# Altium schematic sheet LED.SchDoc
size C
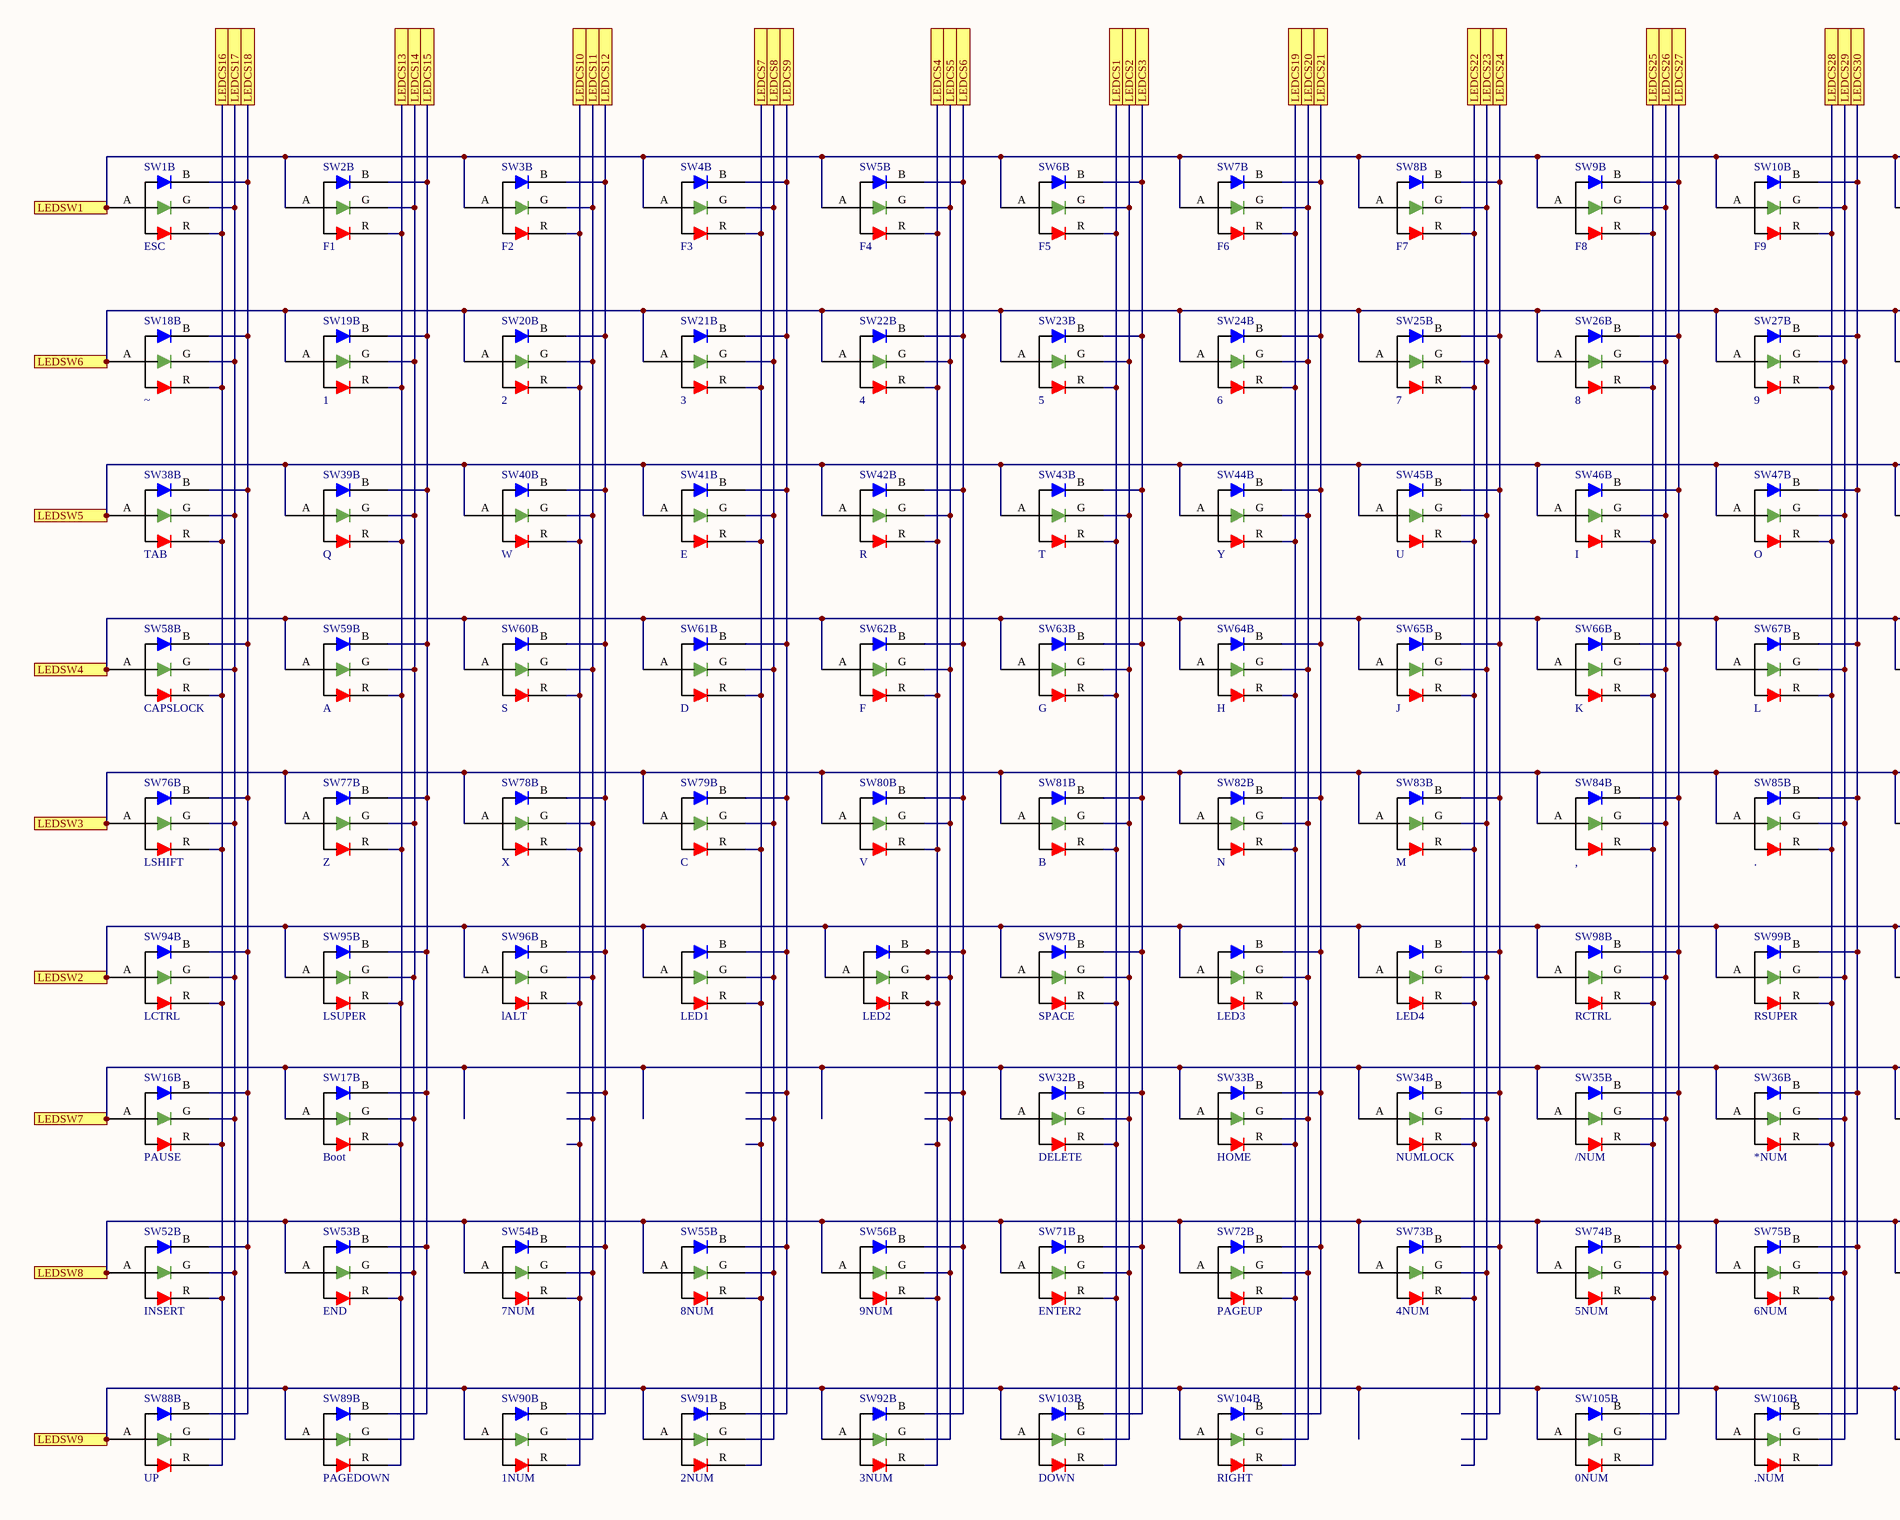
[diagram p0: LED.SchDoc, left]
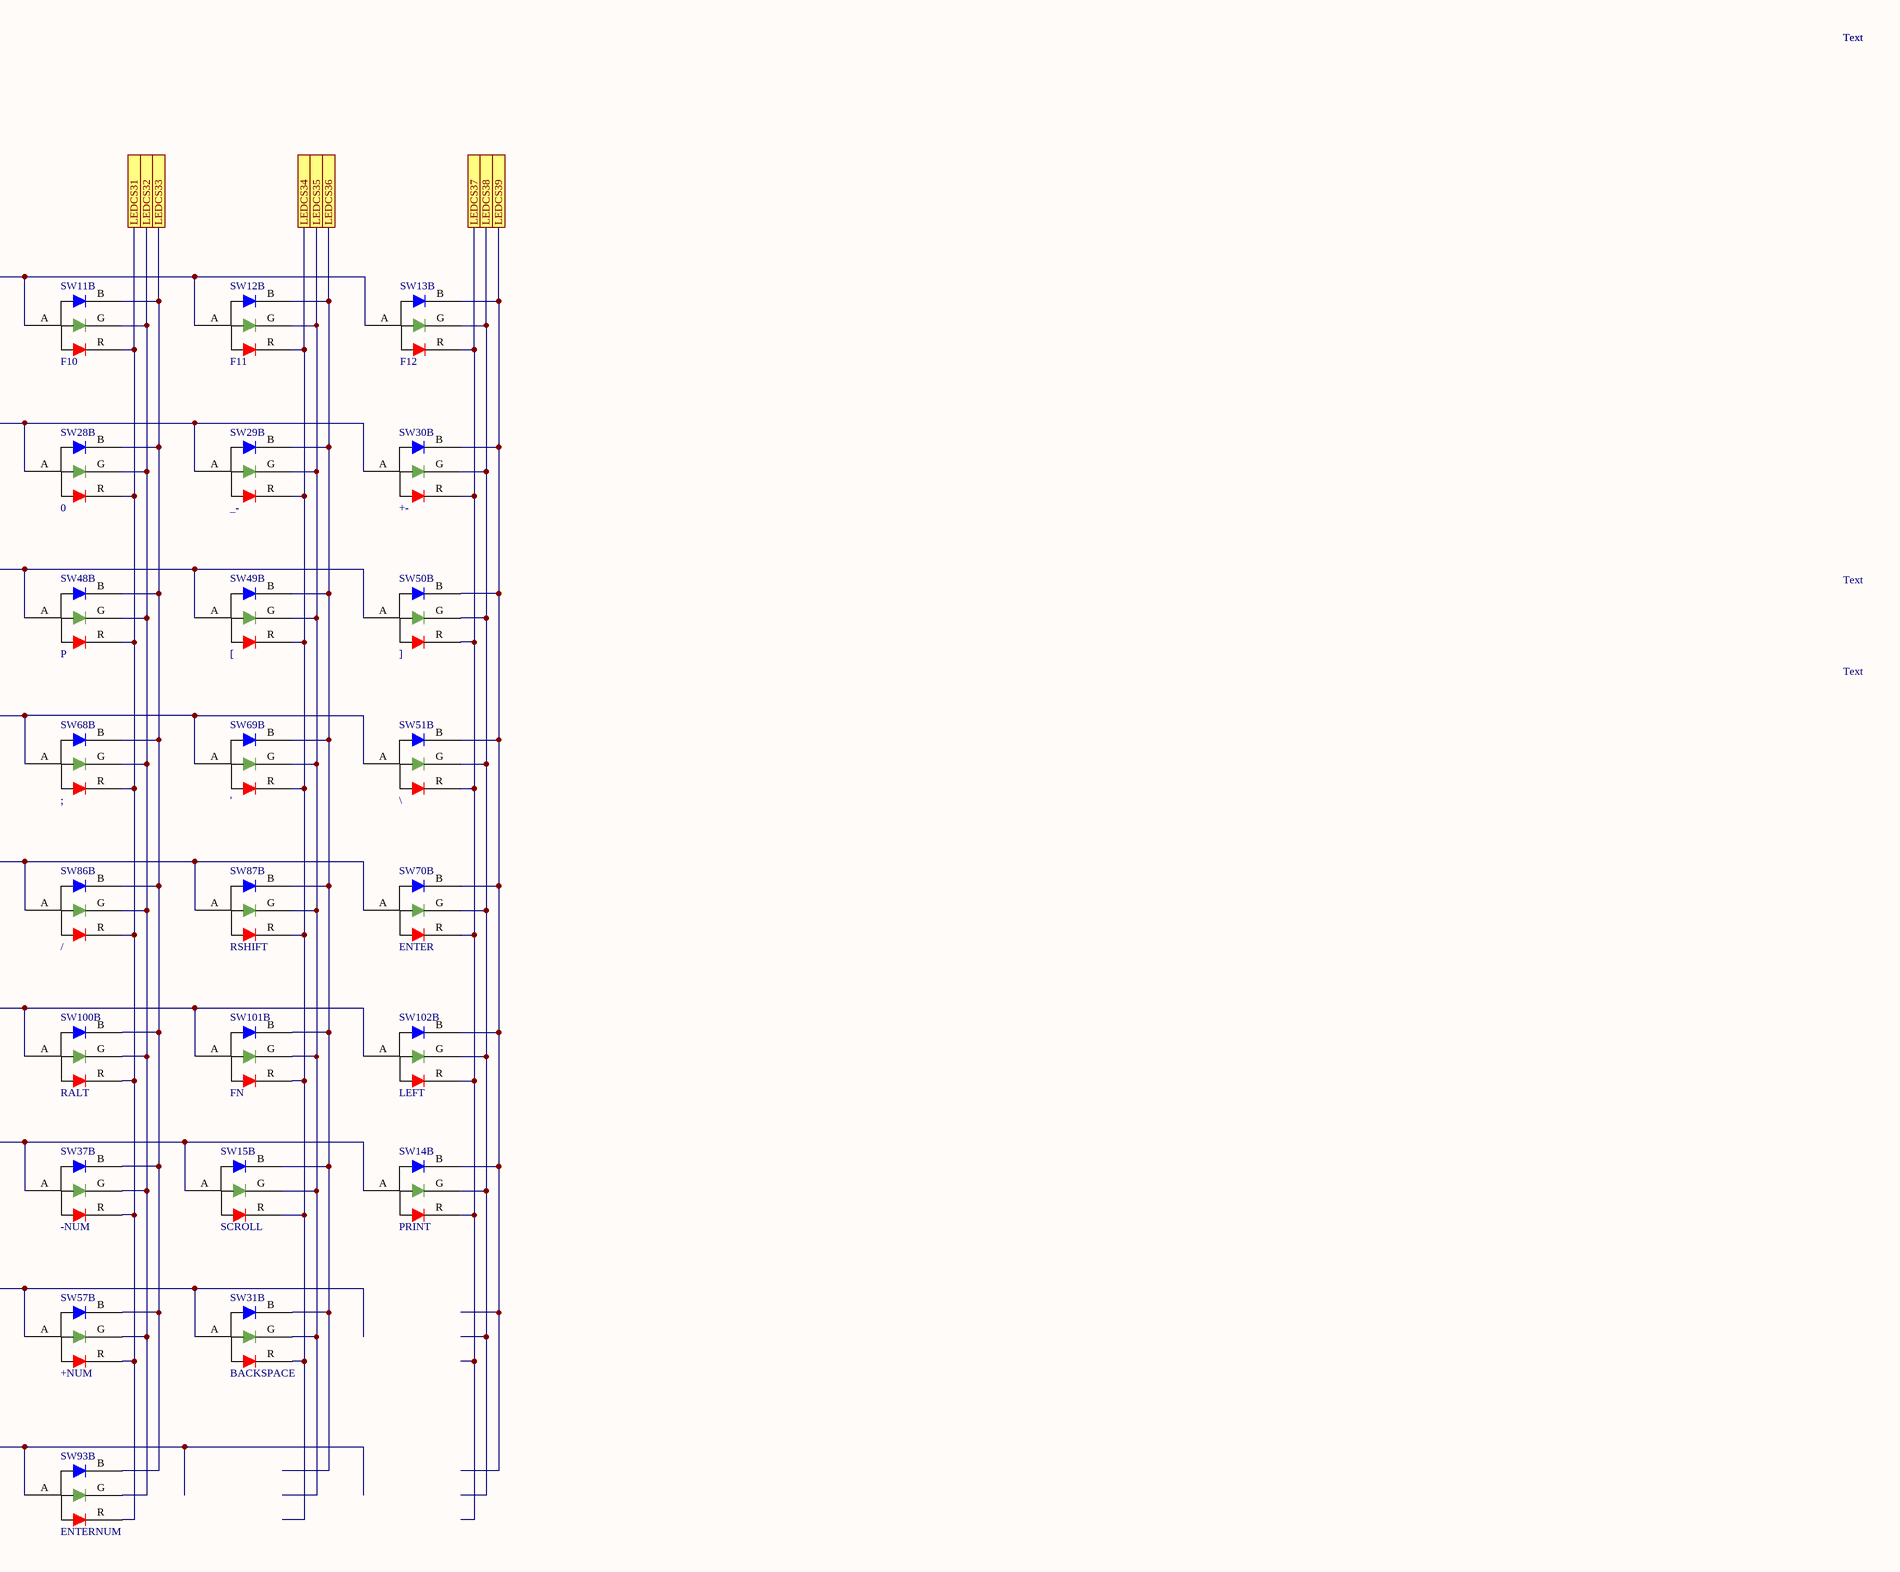
[diagram p1: LED.SchDoc, right]

## Parts
LED1  ASMB-MTB0-0A3A2  [smd led]  (value not drawn)
LED2  ASMB-MTB0-0A3A2  [smd led]  (value not drawn)
LED3  ASMB-MTB0-0A3A2  [smd led]  (value not drawn)
LED4  ASMB-MTB0-0A3A2  [smd led]  (value not drawn)
SW1  ESC  [SWITCH_U1_W_LED]  (part B of 2)
SW2  F1  [SWITCH_U1_W_LED]  (part B of 2)
SW3  F2  [SWITCH_U1_W_LED]  (part B of 2)
SW4  F3  [SWITCH_U1_W_LED]  (part B of 2)
SW5  F4  [SWITCH_U1_W_LED]  (part B of 2)
SW6  F5  [SWITCH_U1_W_LED]  (part B of 2)
SW7  F6  [SWITCH_U1_W_LED]  (part B of 2)
SW8  F7  [SWITCH_U1_W_LED]  (part B of 2)
SW9  F8  [SWITCH_U1_W_LED]  (part B of 2)
SW10  F9  [SWITCH_U1_W_LED]  (part B of 2)
SW11  F10  [SWITCH_U1_W_LED]  (part B of 2)
SW12  F11  [SWITCH_U1_W_LED]  (part B of 2)
SW13  F12  [SWITCH_U1_W_LED]  (part B of 2)
SW14  PRINT  [SWITCH_U1_W_LED]  (part B of 2)
SW15  SCROLL  [SWITCH_U1_W_LED]  (part B of 2)
SW16  PAUSE  [SWITCH_U1_W_LED]  (part B of 2)
SW17  Boot  [SWITCH_U1_W_LED]  (part B of 2)
SW18  ~  [SWITCH_U1_W_LED]  (part B of 2)
SW19  1  [SWITCH_U1_W_LED]  (part B of 2)
SW20  2  [SWITCH_U1_W_LED]  (part B of 2)
SW21  3  [SWITCH_U1_W_LED]  (part B of 2)
SW22  4  [SWITCH_U1_W_LED]  (part B of 2)
SW23  5  [SWITCH_U1_W_LED]  (part B of 2)
SW24  6  [SWITCH_U1_W_LED]  (part B of 2)
SW25  7  [SWITCH_U1_W_LED]  (part B of 2)
SW26  8  [SWITCH_U1_W_LED]  (part B of 2)
SW27  9  [SWITCH_U1_W_LED]  (part B of 2)
SW28  0  [SWITCH_U1_W_LED]  (part B of 2)
SW29  _-  [SWITCH_U1_W_LED]  (part B of 2)
SW30  +-  [SWITCH_U1_W_LED]  (part B of 2)
SW31  BACKSPACE  [SWITCH_U2_W_LED]  (part B of 2)
SW32  DELETE  [SWITCH_U1_W_LED]  (part B of 2)
SW33  HOME  [SWITCH_U1_W_LED]  (part B of 2)
SW34  NUMLOCK  [SWITCH_U1_W_LED]  (part B of 2)
SW35  /NUM  [SWITCH_U1_W_LED]  (part B of 2)
SW36  *NUM  [SWITCH_U1_W_LED]  (part B of 2)
SW37  -NUM  [SWITCH_U1_W_LED]  (part B of 2)
SW38  TAB  [SWITCH_U1.50_W_LED]  (part B of 2)
SW39  Q  [SWITCH_U1_W_LED]  (part B of 2)
SW40  W  [SWITCH_U1_W_LED]  (part B of 2)
SW41  E  [SWITCH_U1_W_LED]  (part B of 2)
SW42  R  [SWITCH_U1_W_LED]  (part B of 2)
SW43  T  [SWITCH_U1_W_LED]  (part B of 2)
SW44  Y  [SWITCH_U1_W_LED]  (part B of 2)
SW45  U  [SWITCH_U1_W_LED]  (part B of 2)
SW46  I  [SWITCH_U1_W_LED]  (part B of 2)
SW47  O  [SWITCH_U1_W_LED]  (part B of 2)
SW48  P  [SWITCH_U1_W_LED]  (part B of 2)
SW49  [  [SWITCH_U1_W_LED]  (part B of 2)
SW50  ]  [SWITCH_U1_W_LED]  (part B of 2)
SW51  \  [SWITCH_U1.50_W_LED]  (part B of 2)
SW52  INSERT  [SWITCH_U1_W_LED]  (part B of 2)
SW53  END  [SWITCH_U1_W_LED]  (part B of 2)
SW54  7NUM  [SWITCH_U1_W_LED]  (part B of 2)
SW55  8NUM  [SWITCH_U1_W_LED]  (part B of 2)
SW56  9NUM  [SWITCH_U1_W_LED]  (part B of 2)
SW57  +NUM  [SWITCH_U2_W_LED - vert]  (part B of 2)
SW58  CAPSLOCK  [SWITCH_U1.75_W_LED]  (part B of 2)
SW59  A  [SWITCH_U1_W_LED]  (part B of 2)
SW60  S  [SWITCH_U1_W_LED]  (part B of 2)
SW61  D  [SWITCH_U1_W_LED]  (part B of 2)
SW62  F  [SWITCH_U1_W_LED]  (part B of 2)
SW63  G  [SWITCH_U1_W_LED]  (part B of 2)
SW64  H  [SWITCH_U1_W_LED]  (part B of 2)
SW65  J  [SWITCH_U1_W_LED]  (part B of 2)
SW66  K  [SWITCH_U1_W_LED]  (part B of 2)
SW67  L  [SWITCH_U1_W_LED]  (part B of 2)
SW68  ;  [SWITCH_U1_W_LED]  (part B of 2)
SW69  '  [SWITCH_U1_W_LED]  (part B of 2)
SW70  ENTER  [SWITCH_U2.25_W_LED]  (part B of 2)
SW71  ENTER2  [SWITCH_U1_W_LED]  (part B of 2)
SW72  PAGEUP  [SWITCH_U1_W_LED]  (part B of 2)
SW73  4NUM  [SWITCH_U1_W_LED]  (part B of 2)
SW74  5NUM  [SWITCH_U1_W_LED]  (part B of 2)
SW75  6NUM  [SWITCH_U1_W_LED]  (part B of 2)
SW76  LSHIFT  [SWITCH_U2.25_W_LED]  (part B of 2)
SW77  Z  [SWITCH_U1_W_LED]  (part B of 2)
SW78  X  [SWITCH_U1_W_LED]  (part B of 2)
SW79  C  [SWITCH_U1_W_LED]  (part B of 2)
SW80  V  [SWITCH_U1_W_LED]  (part B of 2)
SW81  B  [SWITCH_U1_W_LED]  (part B of 2)
SW82  N  [SWITCH_U1_W_LED]  (part B of 2)
SW83  M  [SWITCH_U1_W_LED]  (part B of 2)
SW84  ,  [SWITCH_U1_W_LED]  (part B of 2)
SW85  .  [SWITCH_U1_W_LED]  (part B of 2)
SW86  /  [SWITCH_U1_W_LED]  (part B of 2)
SW87  RSHIFT  [SWITCH_U2.75_W_LED]  (part B of 2)
SW88  UP  [SWITCH_U1_W_LED]  (part B of 2)
SW89  PAGEDOWN  [SWITCH_U1_W_LED]  (part B of 2)
SW90  1NUM  [SWITCH_U1_W_LED]  (part B of 2)
SW91  2NUM  [SWITCH_U1_W_LED]  (part B of 2)
SW92  3NUM  [SWITCH_U1_W_LED]  (part B of 2)
SW93  ENTERNUM  [SWITCH_U2_W_LED - vert]  (part B of 2)
SW94  LCTRL  [SWITCH_U1.25_W_LED]  (part B of 2)
SW95  LSUPER  [SWITCH_U1.25_W_LED]  (part B of 2)
SW96  lALT  [SWITCH_U1.25_W_LED]  (part B of 2)
SW97  SPACE  [SWITCH_U6.25_W_LED - duplicate]  (part B of 2)
SW98  RCTRL  [SWITCH_U1_W_LED]  (part B of 2)
SW99  RSUPER  [SWITCH_U1_W_LED]  (part B of 2)
SW100  RALT  [SWITCH_U1_W_LED]  (part B of 2)
SW101  FN  [SWITCH_U1_W_LED]  (part B of 2)
SW102  LEFT  [SWITCH_U1_W_LED]  (part B of 2)
SW103  DOWN  [SWITCH_U1_W_LED]  (part B of 2)
SW104  RIGHT  [SWITCH_U1_W_LED]  (part B of 2)
SW105  0NUM  [SWITCH_U2_W_LED]  (part B of 2)
SW106  .NUM  [SWITCH_U1_W_LED]  (part B of 2)

## Ports
LEDCS1, LEDCS2, LEDCS3, LEDCS4, LEDCS5, LEDCS6, LEDCS7, LEDCS8, LEDCS9, LEDCS10, LEDCS11, LEDCS12, LEDCS13, LEDCS14, LEDCS15, LEDCS16, LEDCS17, LEDCS18, LEDCS19, LEDCS20, LEDCS21, LEDCS22, LEDCS23, LEDCS24, LEDCS25, LEDCS26, LEDCS27, LEDCS28, LEDCS29, LEDCS30, LEDCS31, LEDCS32, LEDCS33, LEDCS34, LEDCS35, LEDCS36, LEDCS37, LEDCS38, LEDCS39, LEDSW1, LEDSW2, LEDSW3, LEDSW4, LEDSW5, LEDSW6, LEDSW7, LEDSW8, LEDSW9

## Nets
LEDCS1: SW6.R SW23.R SW32.R SW43.R SW63.R SW71.R SW81.R SW97.R SW103.R ; port LEDCS1
LEDCS2: SW6.G SW23.G SW32.G SW43.G SW63.G SW71.G SW81.G SW97.G SW103.G ; port LEDCS2
LEDCS3: SW6.B SW23.B SW32.B SW43.B SW63.B SW71.B SW81.B SW97.B SW103.B ; port LEDCS3
LEDCS4: LED2.R SW5.R SW22.R SW42.R SW56.R SW62.R SW80.R SW92.R ; port LEDCS4
LEDCS5: LED2.G SW5.G SW22.G SW42.G SW56.G SW62.G SW80.G SW92.G ; port LEDCS5
LEDCS6: LED2.B SW5.B SW22.B SW42.B SW56.B SW62.B SW80.B SW92.B ; port LEDCS6
LEDCS7: LED1.R SW4.R SW21.R SW41.R SW55.R SW61.R SW79.R SW91.R ; port LEDCS7
LEDCS8: LED1.G SW4.G SW21.G SW41.G SW55.G SW61.G SW79.G SW91.G ; port LEDCS8
LEDCS9: LED1.B SW4.B SW21.B SW41.B SW55.B SW61.B SW79.B SW91.B ; port LEDCS9
LEDCS10: SW3.R SW20.R SW40.R SW54.R SW60.R SW78.R SW90.R SW96.R ; port LEDCS10
LEDCS11: SW3.G SW20.G SW40.G SW54.G SW60.G SW78.G SW90.G SW96.G ; port LEDCS11
LEDCS12: SW3.B SW20.B SW40.B SW54.B SW60.B SW78.B SW90.B SW96.B ; port LEDCS12
LEDCS13: SW2.R SW17.R SW19.R SW39.R SW53.R SW59.R SW77.R SW89.R SW95.R ; port LEDCS13
LEDCS14: SW2.G SW17.G SW19.G SW39.G SW53.G SW59.G SW77.G SW89.G SW95.G ; port LEDCS14
LEDCS15: SW2.B SW17.B SW19.B SW39.B SW53.B SW59.B SW77.B SW89.B SW95.B ; port LEDCS15
LEDCS16: SW1.R SW16.R SW18.R SW38.R SW52.R SW58.R SW76.R SW88.R SW94.R ; port LEDCS16
LEDCS17: SW1.G SW16.G SW18.G SW38.G SW52.G SW58.G SW76.G SW88.G SW94.G ; port LEDCS17
LEDCS18: SW1.B SW16.B SW18.B SW38.B SW52.B SW58.B SW76.B SW88.B SW94.B ; port LEDCS18
LEDCS19: LED3.R SW7.R SW24.R SW33.R SW44.R SW64.R SW72.R SW82.R SW104.R ; port LEDCS19
LEDCS20: LED3.G SW7.G SW24.G SW33.G SW44.G SW64.G SW72.G SW82.G SW104.G ; port LEDCS20
LEDCS21: LED3.B SW7.B SW24.B SW33.B SW44.B SW64.B SW72.B SW82.B SW104.B ; port LEDCS21
LEDCS22: LED4.R SW8.R SW25.R SW34.R SW45.R SW65.R SW73.R SW83.R ; port LEDCS22
LEDCS23: LED4.G SW8.G SW25.G SW34.G SW45.G SW65.G SW73.G SW83.G ; port LEDCS23
LEDCS24: LED4.B SW8.B SW25.B SW34.B SW45.B SW65.B SW73.B SW83.B ; port LEDCS24
LEDCS25: SW9.R SW26.R SW35.R SW46.R SW66.R SW74.R SW84.R SW98.R SW105.R ; port LEDCS25
LEDCS26: SW9.G SW26.G SW35.G SW46.G SW66.G SW74.G SW84.G SW98.G SW105.G ; port LEDCS26
LEDCS27: SW9.B SW26.B SW35.B SW46.B SW66.B SW74.B SW84.B SW98.B SW105.B ; port LEDCS27
LEDCS28: SW10.R SW27.R SW36.R SW47.R SW67.R SW75.R SW85.R SW99.R SW106.R ; port LEDCS28
LEDCS29: SW10.G SW27.G SW36.G SW47.G SW67.G SW75.G SW85.G SW99.G SW106.G ; port LEDCS29
LEDCS30: SW10.B SW27.B SW36.B SW47.B SW67.B SW75.B SW85.B SW99.B SW106.B ; port LEDCS30
LEDCS31: SW11.R SW28.R SW37.R SW48.R SW57.R SW68.R SW86.R SW93.R SW100.R ; port LEDCS31
LEDCS32: SW11.G SW28.G SW37.G SW48.G SW57.G SW68.G SW86.G SW93.G SW100.G ; port LEDCS32
LEDCS33: SW11.B SW28.B SW37.B SW48.B SW57.B SW68.B SW86.B SW93.B SW100.B ; port LEDCS33
LEDCS34: SW12.R SW15.R SW29.R SW31.R SW49.R SW69.R SW87.R SW101.R ; port LEDCS34
LEDCS35: SW12.G SW15.G SW29.G SW31.G SW49.G SW69.G SW87.G SW101.G ; port LEDCS35
LEDCS36: SW12.B SW15.B SW29.B SW31.B SW49.B SW69.B SW87.B SW101.B ; port LEDCS36
LEDCS37: SW13.R SW14.R SW30.R SW50.R SW51.R SW70.R SW102.R ; port LEDCS37
LEDCS38: SW13.G SW14.G SW30.G SW50.G SW51.G SW70.G SW102.G ; port LEDCS38
LEDCS39: SW13.B SW14.B SW30.B SW50.B SW51.B SW70.B SW102.B ; port LEDCS39
LEDSW1: SW1.A SW2.A SW3.A SW4.A SW5.A SW6.A SW7.A SW8.A SW9.A SW10.A SW11.A SW12.A SW13.A ; port LEDSW1
LEDSW2: LED1.A LED2.A LED3.A LED4.A SW94.A SW95.A SW96.A SW97.A SW98.A SW99.A SW100.A SW101.A SW102.A ; port LEDSW2
LEDSW3: SW70.A SW76.A SW77.A SW78.A SW79.A SW80.A SW81.A SW82.A SW83.A SW84.A SW85.A SW86.A SW87.A ; port LEDSW3
LEDSW4: SW51.A SW58.A SW59.A SW60.A SW61.A SW62.A SW63.A SW64.A SW65.A SW66.A SW67.A SW68.A SW69.A ; port LEDSW4
LEDSW5: SW38.A SW39.A SW40.A SW41.A SW42.A SW43.A SW44.A SW45.A SW46.A SW47.A SW48.A SW49.A SW50.A ; port LEDSW5
LEDSW6: SW18.A SW19.A SW20.A SW21.A SW22.A SW23.A SW24.A SW25.A SW26.A SW27.A SW28.A SW29.A SW30.A ; port LEDSW6
LEDSW7: SW14.A SW15.A SW16.A SW17.A SW32.A SW33.A SW34.A SW35.A SW36.A SW37.A ; port LEDSW7
LEDSW8: SW31.A SW52.A SW53.A SW54.A SW55.A SW56.A SW57.A SW71.A SW72.A SW73.A SW74.A SW75.A ; port LEDSW8
LEDSW9: SW88.A SW89.A SW90.A SW91.A SW92.A SW93.A SW103.A SW104.A SW105.A SW106.A ; port LEDSW9

## Notes on the sheet
- Text
- Title
- Size:
- Date:
- File:
- C
- Number:
- Time:
- Revision:
- Sheet
- of

## Library data of the parts
SW1-SW106 = MX_SWITCH_SINGLE_W_SMD_LED: Supplier 1: Mouser; Supplier Part Number 1: 630-ASMB-MTB0-0A3A2
LED1-LED4 = ASMB-MTB0-0A3A2: Supplier 1: Mouser; Supplier Part Number 1: 630-ASMB-MTB0-0A3A2